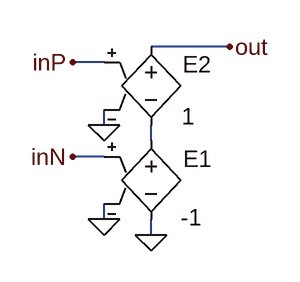
[diagram p0: schematic subtr.asc]
subtr.asc, the LTspice schematic file:
Version 4
SHEET 1 880 680
WIRE 288 16 208 16
WIRE 160 32 128 32
WIRE 160 96 160 80
WIRE 208 112 208 96
WIRE 160 128 128 128
WIRE 160 192 160 176
WIRE 208 208 208 192
FLAG 208 208 0
FLAG 160 96 0
FLAG 128 128 inN
FLAG 128 32 inP
FLAG 288 16 out
FLAG 160 192 0
SYMBOL e 208 96 R0
WINDOW 0 33 34 Left 0
WINDOW 3 30 94 Left 0
SYMATTR InstName E1
SYMATTR Value -1
SYMBOL e 208 0 R0
WINDOW 0 32 34 Left 0
WINDOW 3 31 87 Left 0
SYMATTR InstName E2
SYMATTR Value 1

The netlist it stands for:
* subtr.asc
E1 N001 0 inN 0 -1
E2 out N001 inP 0 1
.backanno
.end